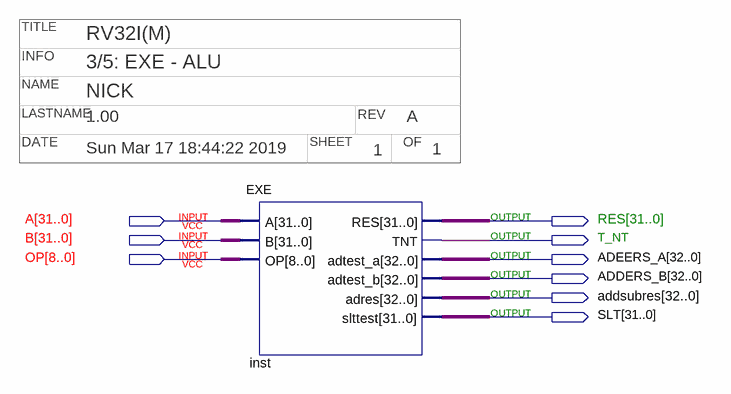
[diagram p0: schematic sheet]
// Quartus schematic EXETEST.bdf as structural Verilog: 1 symbols, 9 pins
// Title block: TITLE: RV32I(M); INFO: 3/5: EXE - ALU; NAME: NICK; LASTNAME: 1.00; REV: A; DATE: Sun Mar 17 18:44:22 2019; SHEET: 1; OF: 1
module EXETEST (
  input  [31:0] A,
  input  [31:0] B,
  input  [8:0] OP,
  output [31:0] RES,
  output T_NT,
  output [32:0] ADEERS_A,
  output [32:0] ADDERS_B,
  output [32:0] addsubres,
  output [31:0] SLT
);

  EXE inst (
    .A(A), .B(B), .OP(OP), .RES(RES), .TNT(T_NT), .adtest_a(ADEERS_A), .adtest_b(ADDERS_B),
    .adres(addsubres), .slttest(SLT));
endmodule
